# EAGLE schematic untitled2 (EAGLE 9.6.2)
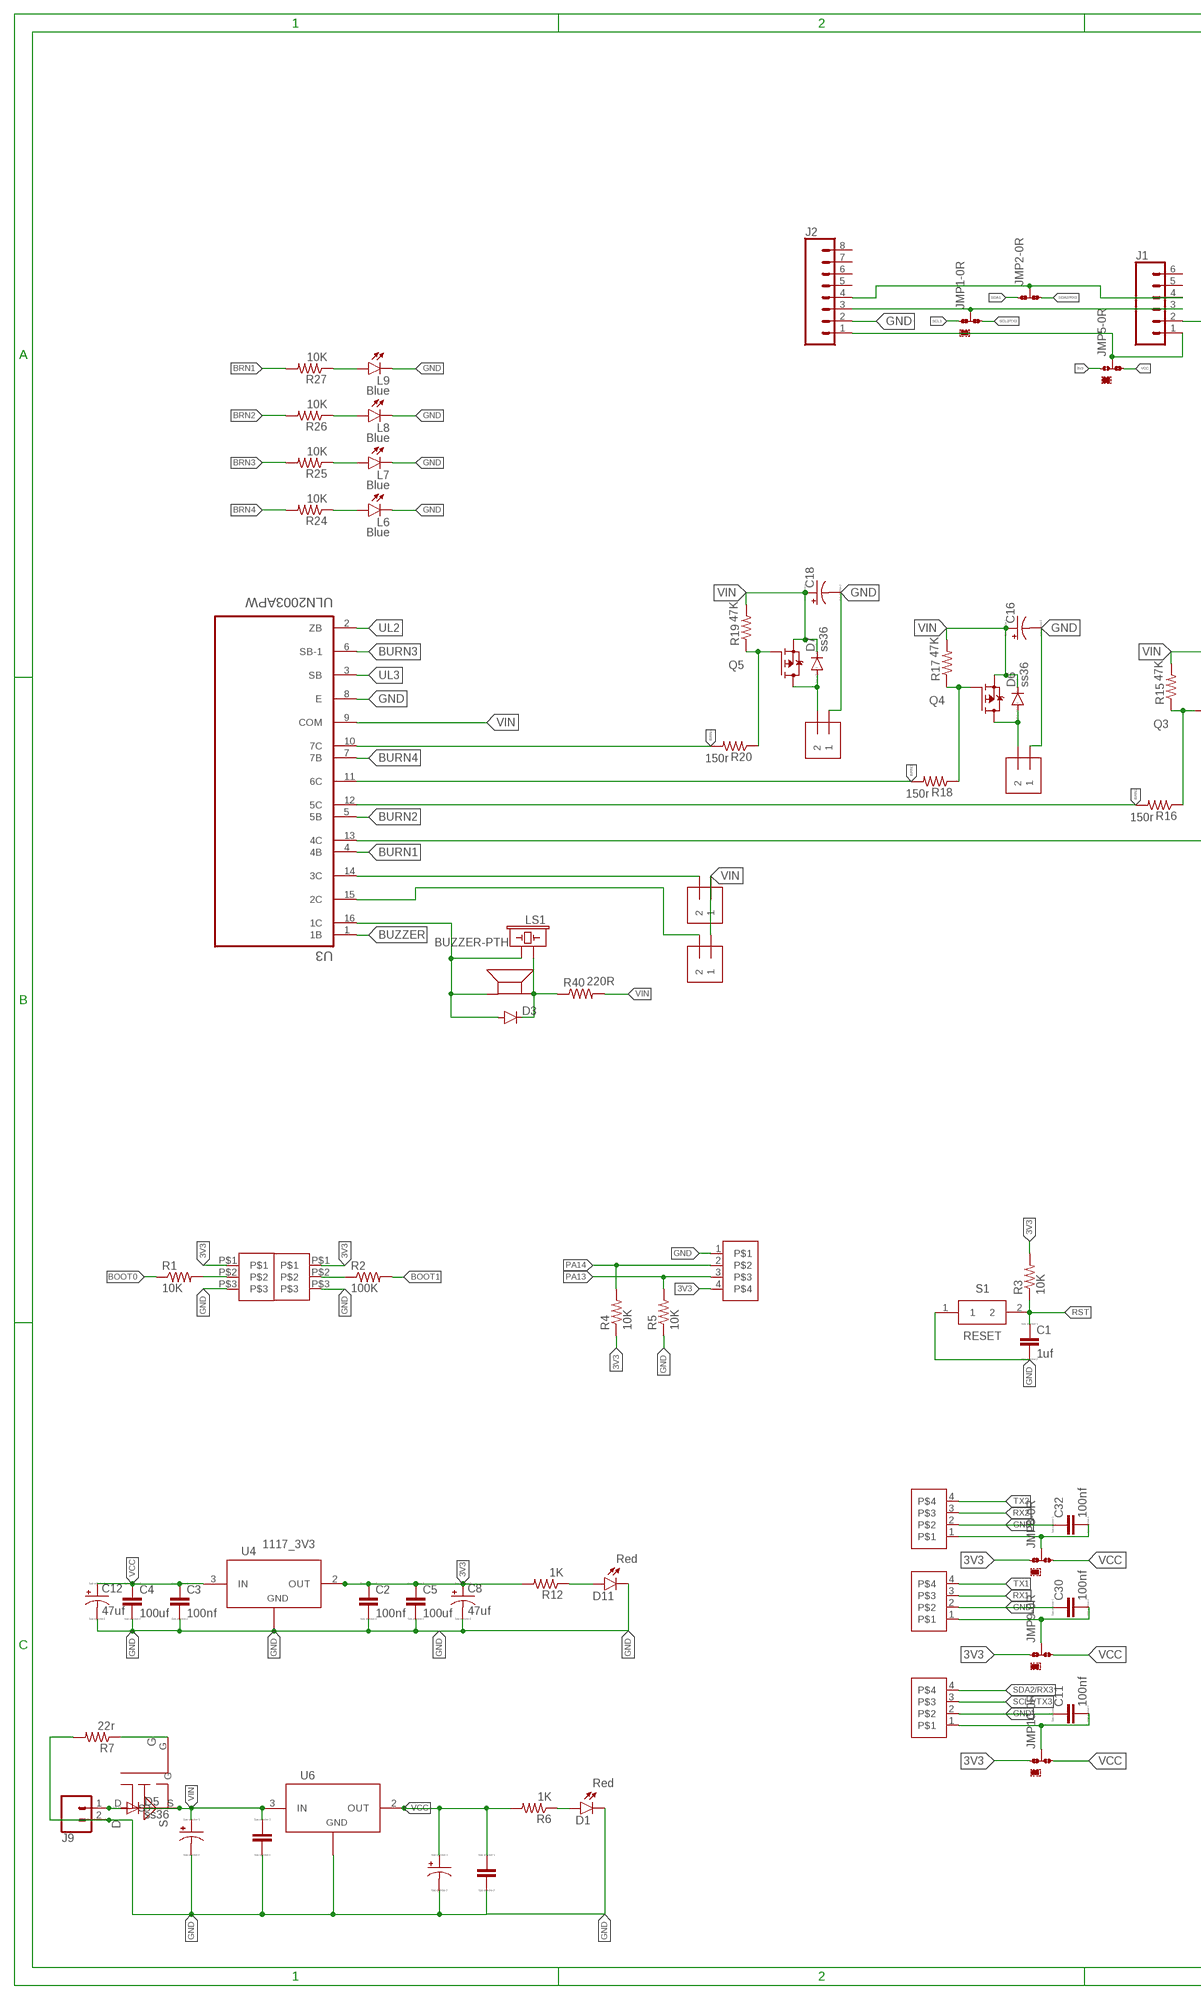
[diagram p0: schematic, sheet 1, part 1 of 2]
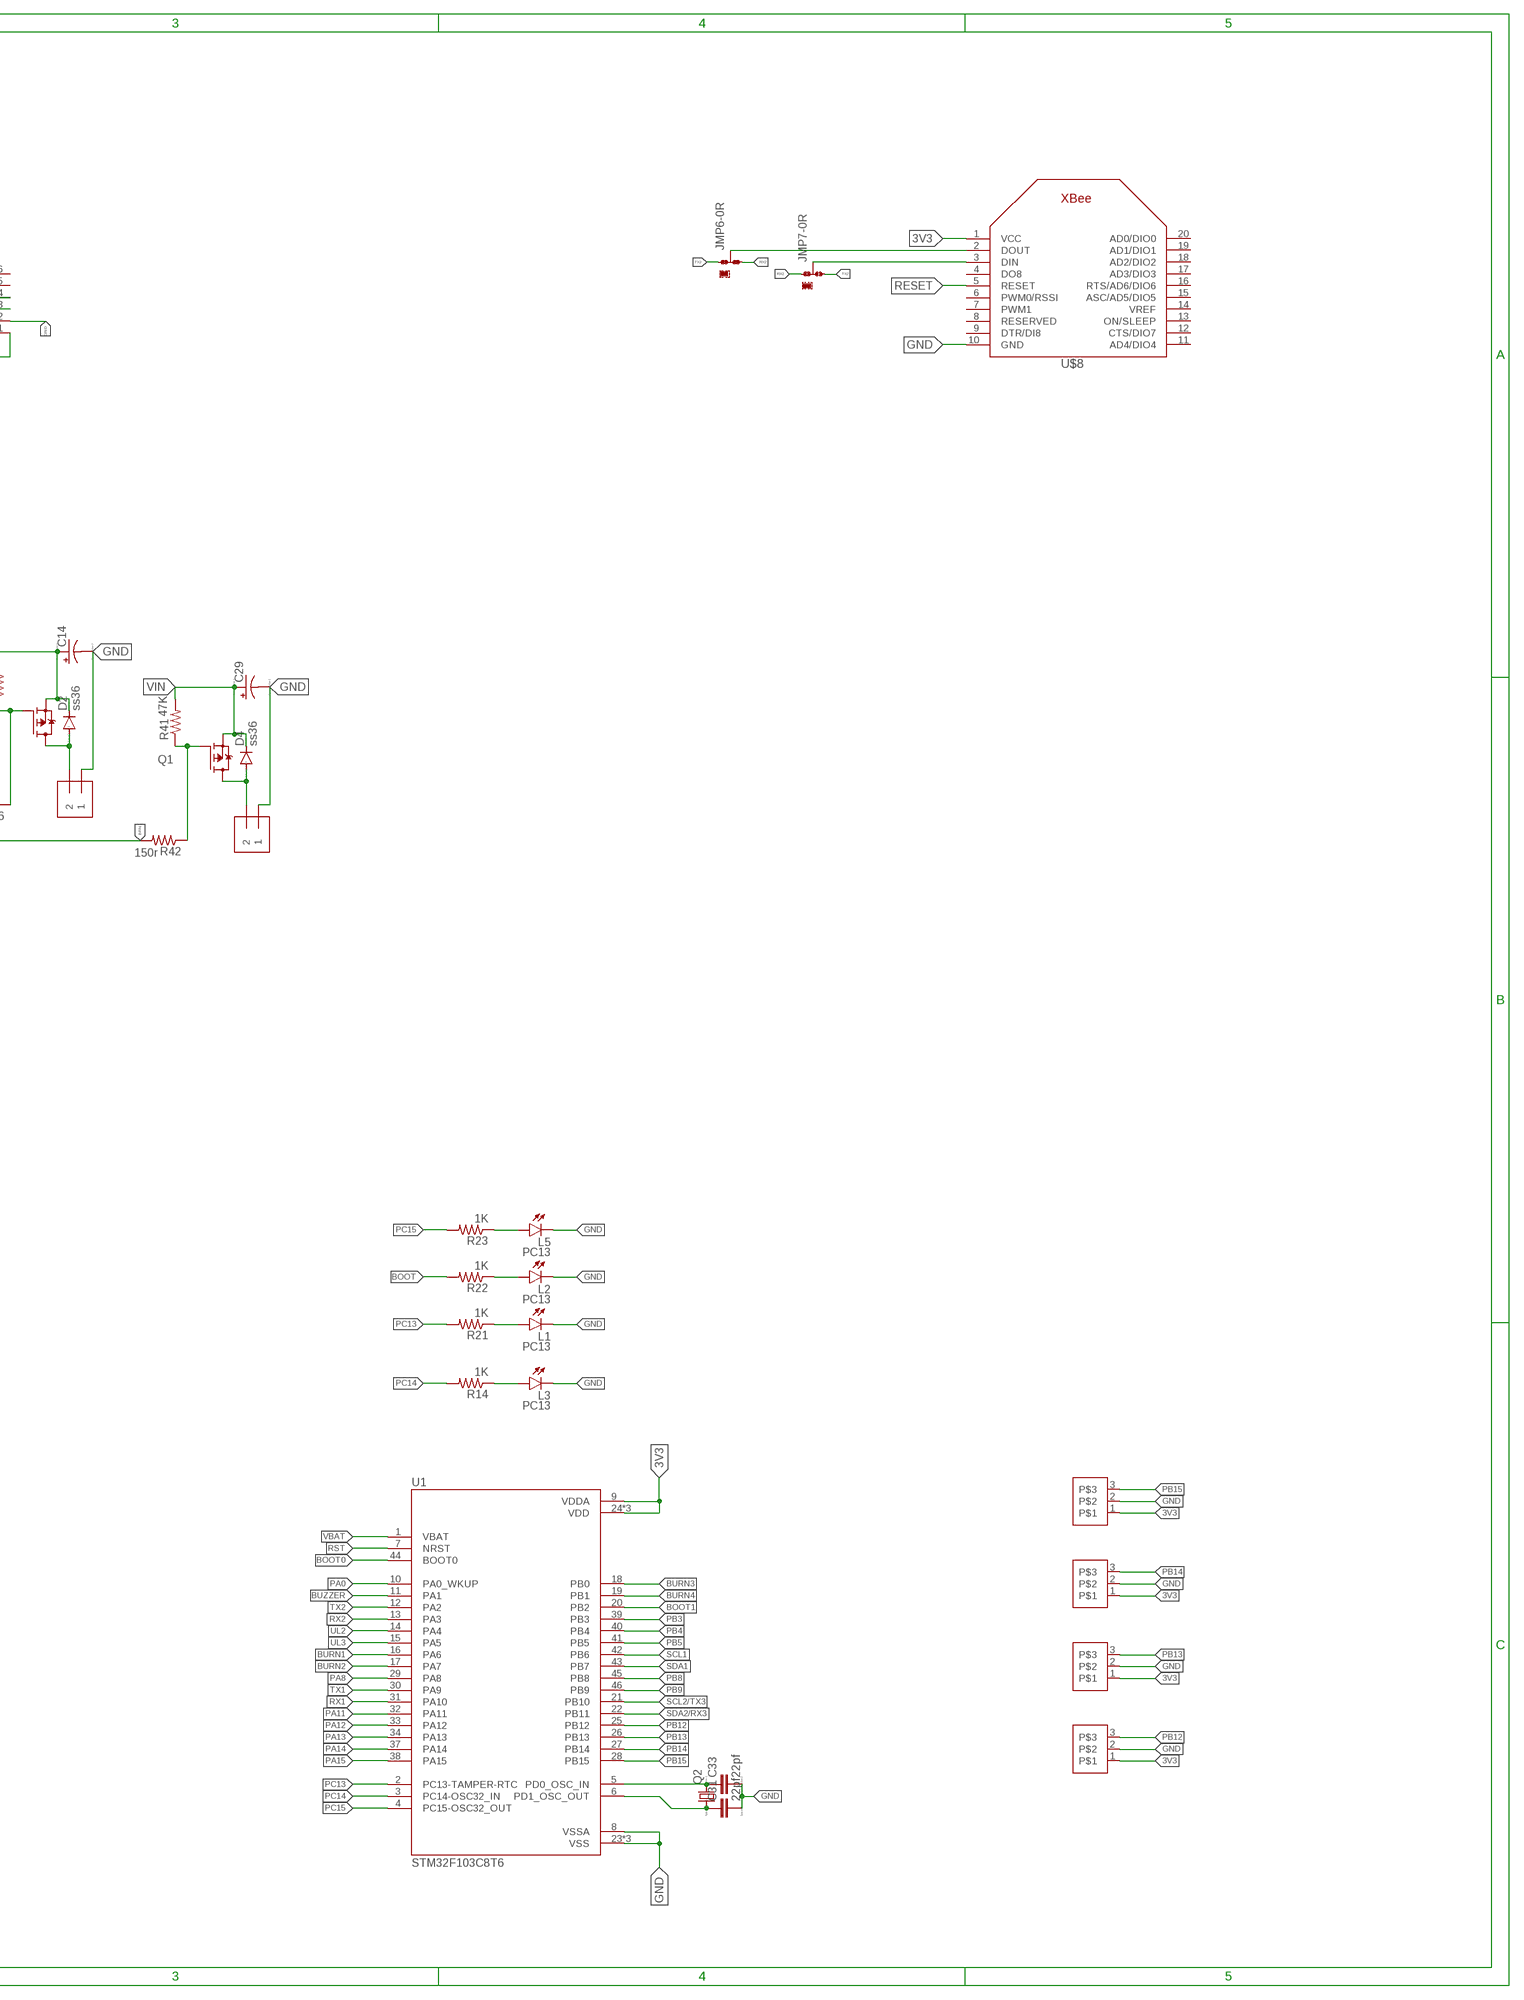
[diagram p1: schematic, sheet 1, part 2 of 2]

## Parts
C1  1uf  CAPACITOR_CER4  [C0603]
C2  100nf  CAPACITOR_CER4  [C0603]
C3  100nf  CAPACITOR_CER4  [C0603]
C4  100uf  CAPACITOR_CER9  [C1210]
C5  100uf  CAPACITOR_CER9  [C1210]
C6  100nf  CAPACITOR_CER4  [C0603]
C7  100uf  CAPACITOR_POLD  [PANASONIC_D]
C8  47uf  CAPACITOR_POLC  [PANASONIC_C]
C9  100nf  CAPACITOR_CER4  [C0603]
C10  100uf  CAPACITOR_POLD  [PANASONIC_D]
C11  100nf  CAPACITOR_CER4  [C0603]
C12  47uf  CAPACITOR_POLC  [PANASONIC_C]
C14  CAPACITOR_POLC  [PANASONIC_C]
C16  CAPACITOR_POLC  [PANASONIC_C]
C18  CAPACITOR_POLC  [PANASONIC_C]
C29  CAPACITOR_POLC  [PANASONIC_C]
C30  100nf  CAPACITOR_CER4  [C0603]
C31  22pf  CAPACITOR_CER4  [C0603]
C32  100nf  CAPACITOR_CER4  [C0603]
C33  22pf  CAPACITOR_CER4  [C0603]
D1  Red  LED0603_R  [0603_LED_GREEN]
D2  ss36  DIODEAC2  [DO-214AC]
D3  DIODESOD  [SOD-323]
D4  ss36  DIODEAC2  [DO-214AC]
D5  ss36  DIODEAC2  [DO-214AC]
D6  ss36  DIODEAC2  [DO-214AC]
D7  ss36  DIODEAC2  [DO-214AC]
D11  Red  LED0603_R  [0603_LED_GREEN]
J1  CONN_06NO_SILK_NO_POP  [1X06_NO_SILK]
J2  CONN_08NO_SILK_FEMALE_PTH  [1X08_NO_SILK]
J9  CONN_025MM  [SCREWTERMINAL-5MM-2]
JMP1  0R-JUMPA  [A0R-JMP]
JMP2  0R-JUMPA  [A0R-JMP]
JMP5  0R-JUMPA  [A0R-JMP]
JMP6  0R-JUMPA  [A0R-JMP]
JMP7  0R-JUMPA  [A0R-JMP]
JMP8  0R-JUMPA  [A0R-JMP]
JMP9  0R-JUMPA  [A0R-JMP]
JMP10  0R-JUMPA  [A0R-JMP]
L1  PC13  LED0603_R  [0603_LED_GREEN]
L2  PC13  LED0603_R  [0603_LED_GREEN]
L3  PC13  LED0603_R  [0603_LED_GREEN]
L5  PC13  LED0603_R  [0603_LED_GREEN]
L6  Blue  LED0603_R  [0603_LED_GREEN]
L7  Blue  LED0603_R  [0603_LED_GREEN]
L8  Blue  LED0603_R  [0603_LED_GREEN]
L9  Blue  LED0603_R  [0603_LED_GREEN]
LS1  BUZZER-PTH  [BUZZER-12MM]
Q1  FDD4141TO252  [TO252]
Q2  CRYSTALHC49U-V  [HC49U-V]
Q3  FDD4141TO252  [TO252]
Q4  FDD4141TO252  [TO252]
Q5  FDD4141TO252  [TO252]
Q6  AON7401  [DFN-8_3X3]
R1  10K  RESISTOR0603  [R0603]
R2  100K  RESISTOR0603  [R0603]
R3  10K  RESISTOR0603  [R0603]
R4  10K  RESISTOR0603  [R0603]
R5  10K  RESISTOR0603  [R0603]
R6  1K  RESISTOR0603  [R0603]
R7  22r  RESISTOR0603  [R0603]
R12  1K  RESISTOR0603  [R0603]
R14  1K  RESISTOR0603  [R0603]
R15  47K  RESISTOR0603  [R0603]
R16  150r  RESISTOR0603  [R0603]
R17  47K  RESISTOR0603  [R0603]
R18  150r  RESISTOR0603  [R0603]
R19  47K  RESISTOR0603  [R0603]
R20  150r  RESISTOR0603  [R0603]
R21  1K  RESISTOR0603  [R0603]
R22  1K  RESISTOR0603  [R0603]
R23  1K  RESISTOR0603  [R0603]
R24  10K  RESISTOR0603  [R0603]
R25  10K  RESISTOR0603  [R0603]
R26  10K  RESISTOR0603  [R0603]
R27  10K  RESISTOR0603  [R0603]
R40  220R  RESISTOR0603  [R0603]
R41  47K  RESISTOR0603  [R0603]
R42  150r  RESISTOR0603  [R0603]
S1  RESET  SKRKAEE010  [SKRK]
U1  STM32F103C8T6  [QFP50P900X900X160-48N]
U3  ULN2003APW  [SOP65P640X120-16N]
U4  1117_3V3  NCP1117ST33T3G  [SOT-223]
U6  1117_3V3  NCP1117ST33T3G  [SOT-223]
U$1  FML_1X32MM  [1X3_2MM]
U$2  FML_1X32MM  [1X3_2MM]
U$3  FML_1X4  [HDRVR4W64P254_1X4_1016X240X800B]
U$4  1X2  [1X2]
U$5  1X2  [1X2]
U$6  1X2  [1X2]
U$7  FML_1X4  [HDRVR4W64P254_1X4_1016X240X800B]
U$8  XBEE  [XBEE]
U$9  Z_STOP  FML_1X3  [HDRVR3W64P254_1X3_762X240X800B]
U$11  FML_1X4  [HDRVR4W64P254_1X4_1016X240X800B]
U$12  FML_1X4  [HDRVR4W64P254_1X4_1016X240X800B]
U$13  Z_STOP  FML_1X3  [HDRVR3W64P254_1X3_762X240X800B]
U$14  Y_STOP  FML_1X3  [HDRVR3W64P254_1X3_762X240X800B]
U$15  X_STOP  FML_1X3  [HDRVR3W64P254_1X3_762X240X800B]
U$19  7.5X7.5_BUZZER  [SMD_7.5_BUZZER]
U$20  1X2  [1X2]
U$21  1X2  [1X2]
U$22  1X2  [1X2]

## Nets
3V3: C2.1 C5.1 C8.+ JMP5.1 JMP8.1 JMP9.1 JMP10.1 R3.2 R4.1 R12.2 U1.9(VDDA) U1.24(VDD) U1.36(VDD) U1.48(VDD) U4.2(OUT) U4.4 U$1.P$1 U$2.P$1 U$3.4 U$8.1(VCC) U$9.1 U$13.1 U$14.1 U$15.1
BOOT: R1.2 R22.2 U$2.P$2
BOOT0: R1.1 U1.44(BOOT0)
BOOT1: R2.2 U1.20(PB2)
BRN1: R27.2 R42.2 U3.13(4C)
BRN2: R16.2 R26.2 U3.12(5C)
BRN3: R18.2 R25.2 U3.11(6C)
BRN4: R20.2 R24.2 U3.10(7C)
BURN1: U1.16(PA6) U3.4(4B)
BURN2: U1.17(PA7) U3.5(5B)
BURN3: U1.18(PB0) U3.6(SB-1)
BURN4: U1.19(PB1) U3.7(7B)
BUZZER: U1.11(PA1) U3.1(1B)
GND: C1.2 C2.2 C3.2 C4.2 C5.2 C6.2 C7.- C8.- C9.2 C10.- C11.1 C12.- C14.- C16.- C18.- C29.- C30.1 C31.2 C32.1 C33.2 D1.C D11.C J1.2 J2.2 J9.2 L1.C L2.C L3.C L5.C L6.C L7.C L8.C L9.C R5.1 R7.2 S1.1 U1.8(VSSA) U1.23(VSS) U1.35(VSS) U1.47(VSS) U3.8(E) U4.1(ADJ/GND) U6.1(ADJ/GND) U$1.P$3 U$2.P$3 U$3.1 U$4.P$1 U$5.P$1 U$6.P$1 U$7.2 U$8.10(GND) U$9.2 U$11.2 U$12.2 U$13.2 U$14.2 U$15.2 U$21.P$1
N$2: Q6.G R7.1
N$5: R2.1 U$1.P$2
N$7: D1.A R6.1
N$8: D11.A R12.1
N$9: JMP6.2 U$8.2(DOUT)
N$10: JMP7.2 U$8.3(DIN)
N$11: C30.2 JMP9.2 U$12.1
N$12: L3.A R14.1
N$13: D2.A Q3.3(D) U$4.P$2
N$14: Q3.1(G) R15.1 R16.1
N$15: D6.A Q4.3(D) U$5.P$2
N$16: Q4.1(G) R17.1 R18.1
N$17: D7.A Q5.3(D) U$6.P$2
N$18: Q5.1(G) R19.1 R20.1
N$19: C33.1 Q2.2 U1.5(PD0_OSC_IN)
N$20: C31.1 Q2.1 U1.6(PD1_OSC_OUT)
N$21: L1.A R21.1
N$22: L2.A R22.1
N$23: L5.A R23.1
N$24: L6.A R24.1
N$25: L7.A R25.1
N$26: L8.A R26.1
N$27: L9.A R27.1
N$28: C11.2 JMP10.2 U$7.1
N$29: J1.1 J2.1 JMP5.2
N$30: J1.3 J2.3 JMP1.2
N$31: J1.4 J2.4 JMP2.2
N$49: C32.2 JMP8.2 U$11.1
N$59: D5.A J9.1 Q6.D
N$71: U3.15(2C) U$20.P$2
N$72: U3.14(3C) U$22.P$2
N$76: D3.A LS1.- U3.16(1C) U$19.-
N$77: D3.C LS1.+ R40.1 U$19.+
N$78: D4.A Q1.3(D) U$21.P$2
N$79: Q1.1(G) R41.1 R42.1
PA0: U1.10(PA0_WKUP)
PA8: U1.29(PA8)
PA11: U1.32(PA11)
PA12: U1.33(PA12)
PA13: R5.2 U1.34(PA13) U$3.3
PA14: R4.2 U1.37(PA14) U$3.2
PA15: U1.38(PA15)
PB3: U1.39(PB3)
PB4: U1.40(PB4)
PB5: U1.41(PB5)
PB8: U1.45(PB8)
PB9: U1.46(PB9)
PB12: U1.25(PB12) U$15.3
PB13: U1.26(PB13) U$14.3
PB14: U1.27(PB14) U$13.3
PB15: U1.28(PB15) U$9.3
PC13: R21.2 U1.2(PC13-TAMPER-RTC)
PC14: R14.2 U1.3(PC14-OSC32_IN)
PC15: R23.2 U1.4(PC15-OSC32_OUT)
RESET: U$8.5(RESET)
RST: C1.1 R3.1 S1.2 U1.7(NRST)
RX1: U1.31(PA10) U$12.3
RX2: JMP6.3 JMP7.1 U1.13(PA3) U$11.3
SCL1: JMP1.1 U1.42(PB6)
SCL2/TX3: JMP1.3 U1.21(PB10) U$7.3
SDA1: JMP2.1 U1.43(PB7)
SDA2/RX3: JMP2.3 U1.22(PB11) U$7.4
TX1: U1.30(PA9) U$12.4
TX2: JMP6.1 JMP7.3 U1.12(PA2) U$11.4
UL2: U1.14(PA4) U3.2(ZB)
UL3: U1.15(PA5) U3.3(SB)
VBAT: U1.1(VBAT)
VCC: C3.1 C4.1 C6.1 C7.+ C12.+ JMP5.3 JMP8.3 JMP9.3 JMP10.3 R6.2 U4.3(IN) U6.2(OUT) U6.4
VIN: C9.1 C10.+ C14.+ C16.+ C18.+ C29.+ D2.C D4.C D5.C D6.C D7.C Q1.2(S) Q3.2(S) Q4.2(S) Q5.2(S) Q6.S R15.2 R17.2 R19.2 R40.2 R41.2 U3.9(COM) U6.3(IN) U$20.P$1 U$22.P$1
Unconnected: J1.5 J1.6 J2.5 J2.6 J2.7 J2.8 U$8.4(DO8) U$8.6(PWM0/RSSI) U$8.7(PWM1) U$8.8(RESERVED) U$8.9(DTR/DI8) U$8.11(AD4/DIO4) U$8.12(CTS/DIO7) U$8.13(ON/SLEEP) U$8.14(VREF) U$8.15(ASC/AD5/DIO5) U$8.16(RTS/AD6/DIO6) U$8.17(AD3/DIO3) U$8.18(AD2/DIO2) U$8.19(AD1/DIO1) U$8.20(AD0/DIO0)

## Library data of the parts
C1-C6 C9 C11 C30-C33 = pasif_com1:CAPACITOR_CER
C7 C8 C10 C12 C14 C16 C18 C29 = pasif_com1:CAPACITOR_POL
D1 D11 L1-L3 L5-L9 = pasif_com1:LED
D2 D4-D7 = pasif_com1:DIODE
D3 = BeagleBone_Blue_R3:DIODE: Diode These are standard reverse protection diodes and small signal diodes. SMA package can handle up to about 1A. SOD-323 can handle about 200mA. What the SOD-323 package when ordering, there are some mfgs out there that are 5-pin packages.; PROD_ID: DIO-09646
J1 = SparkFun-Connectors:CONN_06: Multi connection point. Often used as Generic Header-pin footprint for 0.1 inch spaced/style header connections On any of the 0.1 inch spaced packages, you can populate with these: Break Away Headers - Straight <https://www.sparkfun.com/products/116> (PRT-00116) Break Away Male Headers - Right Angle <https://www.sparkfun.com/products/553> (PRT-00553) Female Headers <https://www.sparkfun.com/products/115> (PRT-00115) Break Away Headers - Machine Pin <https://www.sparkfun.com/products/117> (PRT-00117) Break Away Female Headers - Swiss Machine Pin <https://www.sparkfun.com/products/743> (PRT-00743) Arduino Stackable Header - 6 Pin <https://www.sparkfun.com/products/9280> (PRT-09280) For SCREWTERMINALS and SPRING TERMINALS visit here: Screw Terimnals on SparkFun.com <https://www.sparkfun.com/search/results?term=Screw+Terminals> (5mm/3.5mm/2.54mm spacing) This device is also useful as a general connection point to wire up your design to another part of your project. Our various solder wires solder well into these plated through hole pads. Hook-Up Wire - Assortment (Stranded, 22 AWG) <https://www.sparkfun.com/products/11375> (PRT-11375) Hook-Up Wire - Assortment (Solid Core, 22 AWG) <https://www.sparkfun.com/products/11367> (PRT-11367) View the entire wire category on our website here <https://www.sparkfun.com/categories/141>
J2 = SparkFun-Connectors:CONN_08: Multi connection point. Often used as Generic Header-pin footprint for 0.1 inch spaced/style header connections On any of the 0.1 inch spaced packages, you can populate with these: Break Away Headers - Straight <https://www.sparkfun.com/products/116> (PRT-00116) Break Away Male Headers - Right Angle <https://www.sparkfun.com/products/553> (PRT-00553) Female Headers <https://www.sparkfun.com/products/115> (PRT-00115) Break Away Headers - Machine Pin <https://www.sparkfun.com/products/117> (PRT-00117) Break Away Female Headers - Swiss Machine Pin <https://www.sparkfun.com/products/743> (PRT-00743) Arduino Stackable Header - 8 Pin <https://www.sparkfun.com/products/9279> (PRT-09279) For SCREWTERMINALS and SPRING TERMINALS visit here: Screw Terimnals on SparkFun.com <https://www.sparkfun.com/search/results?term=Screw+Terminals> (5mm/3.5mm/2.54mm spacing) This device is also useful as a general connection point to wire up your design to another part of your project. Our various solder wires solder well into these plated through hole pads. Hook-Up Wire - Assortment (Stranded, 22 AWG) <https://www.sparkfun.com/products/11375> (PRT-11375) Hook-Up Wire - Assortment (Solid Core, 22 AWG) <https://www.sparkfun.com/products/11367> (PRT-11367) View the entire wire category on our website here <https://www.sparkfun.com/categories/141> Special notes: Molex polarized connector foot print use with SKU : PRT-08231 with associated crimp pins and housings. 1MM SMD Version SKU: PRT-10208 NOTES ON THE VARIANTS LOCK and LOCK_LONGPADS... This footprint was designed to help hold the alignment of a through-hole component (i.e. 6-pin header) while soldering it into place. You may notice that each hole has been shifted either up or down by 0.005 of an inch from it's more standard position (which is a perfectly straight line). This slight alteration caused the pins (the squares in the middle) to touch the edges of the holes. Because they are alternating, it causes a "brace" to hold the component in place. 0.005 has proven to be the perfect amount of "off-center" position when using our standard breakaway headers. Although looks a little odd when you look at the bare footprint, once you have a header in there, the alteration is very hard to notice. Also,if you push a header all the way into place, it is covered up entirely on the bottom side.; PROD_ID: CONN-08438
J9 = SparkFun-Connectors:CONN_02: Multi connection point. Often used as Generic Header-pin footprint for 0.1 inch spaced/style header connections On any of the 0.1 inch spaced packages, you can populate with these: Break Away Headers - Straight <https://www.sparkfun.com/products/116> (PRT-00116) Break Away Male Headers - Right Angle <https://www.sparkfun.com/products/553> (PRT-00553) Female Headers <https://www.sparkfun.com/products/115> (PRT-00115) Break Away Headers - Machine Pin <https://www.sparkfun.com/products/117> (PRT-00117) Break Away Female Headers - Swiss Machine Pin <https://www.sparkfun.com/products/743> (PRT-00743) For SCREWTERMINALS and SPRING TERMINALS visit here: Screw Terimnals on SparkFun.com <https://www.sparkfun.com/search/results?term=Screw+Terminals> (5mm/3.5mm/2.54mm spacing) This device is also useful as a general connection point to wire up your design to another part of your project. Our various solder wires solder well into these plated through hole pads. Hook-Up Wire - Assortment (Stranded, 22 AWG) <https://www.sparkfun.com/products/11375> (PRT-11375) Hook-Up Wire - Assortment (Solid Core, 22 AWG) <https://www.sparkfun.com/products/11367> (PRT-11367) View the entire wire category on our website here <https://www.sparkfun.com/categories/141> Special notes: Molex polarized connector foot print use with: PRT-08233 with associated crimp pins and housings. 2.54_SCREWTERM for use with PRT-10571. 3.5mm Screw Terminal footprints for PRT-08084 5mm Screw Terminal footprints for use with PRT-08432; SF_SKU: PRT-08432
JMP1 JMP2 JMP5-JMP10 = jump-0r-smd:0R-JUMP: SMD 0R 0805 Jumper
LS1 = SparkFun-Electromechanical:BUZZER: Buzzer Small round buzzers that operate around the audible 2kHz range. You can use these as speakers to create simple music or user interfaces. Variant Overview: PTH - Mini Speaker - PC Mount 12mm 2.048kHz <https://www.sparkfun.com/products/7950> PTH_KIT - Mini Speaker - PC Mount 12mm 2.048kHz <https://www.sparkfun.com/products/7950> KIT simplifies soldering by adding stop mask to one side of the pads. PTH_NO_SILK - Mini Speaker - PC Mount 12mm 2.048kHz <https://www.sparkfun.com/products/7950> No silkscreen indicator of buzzer outline. PTH_KIT_NO_SILK - Mini Speaker - PC Mount 12mm 2.048kHz <https://www.sparkfun.com/products/7950> KIT package w/o silkscreen SMD - Buzzer Audio Magnetic (CCV-084B16) SMD buzzer used on, e.g. the LilyPad Buzzer <https://www.sparkfun.com/products/8463> and RFID USB Reader <https://www.sparkfun.com/products/9963>. SMD_KIT - Buzzer Audio Magnetic (CCV-084B16) SMD Buzzer with elongated pins to make soldering easier. Used on the SparkFun Simon Says - Surface Mount Soldering Kit <https://www.sparkfun.com/products/10935>.; PROD_ID: COMP-08253; SF_SKU: COM-07950
Q1 Q3-Q5 = transistor-fet:FDD4141: P-Channel PowerTrench® MOSFET Source: FDD4141.pdf
Q2 = crystal:CRYSTAL: CRYSTAL; OC_FARNELL: 1666969; OC_NEWARK: unknown
Q6 = AON7401:AON7401
R1-R7 R12 R14-R27 R40-R42 = pasif_com1:RESISTOR
S1 = SKRKAEE010:SKRKAEE010: Tactile Switches 3.9x2.9x2.0mm 160gf Packaging Temp 60oC <https://componentsearchengine.com/Images/1/SKRKAEE010.jpg> Source: Datasheet <http://www.mouser.com/ds/2/15/SKRK-1110686.pdf>; AVAILABILITY: Unavailable; DESCRIPTION: Switch Tactile N.O. SPST Round Button Gull Wing 0.05A 12VDC 1.57N SMD T/R; MF: ALPS; MP: SKRKAEE010; PACKAGE: None; PRICE: None
U1 = STM32F103C8T6:STM32F103C8T6: Mainstream Performance line, ARM Cortex-M3 MCU with 64 Kbytes Flash, 72 MHz CPU, motor control, USB and CAN; AVAILABILITY: Unavailable; DESCRIPTION: Mainstream Performance line, ARM Cortex-M3 MCU with 64 Kbytes Flash, 72 MHz CPU, motor control, USB and CAN; MF: STMicroelectronics; MP: STM32F103C8T6; PACKAGE: LQFP-48 STMicroelectronics; PRICE: None
U3 = ULN2003APW:ULN2003APW: Check prices <https://pricing.snapeda.com/parts/ULN2003APW/Texas%20Instruments/view-part?ref=eda>; AVAILABILITY: Good; DESCRIPTION: 50-V, 7-ch darlington transistor array, -20C to 70C 16-TSSOP -40 to 70; MF: Texas Instruments; MP: ULN2003APW; PACKAGE: TSSOP-16 Texas Instruments; PRICE: None; PURCHASE-URL: https://pricing.snapeda.com/search/part/ULN2003APW/?ref=eda
U4 U6 = IC:NCP1117ST33T3G: IC REG LINEAR 3.3V 1A SOT223 Manufacturer's datasheet <https://www.onsemi.com/pub/Collateral/NCP1117-D.PDF>; CREATED_BY: PCBLayout.com; DIGIKEY_PART_NUMBER: NCP1117ST33T3GOSTR-ND; MANUFACTURER: ON Semiconductor; MPN: NCP1117ST33T3G; PACKAGE: SOT-223
U$1 U$2 U$9 U$13-U$15 = header_3d:FML_1X3
U$3 U$7 U$11 U$12 = header_3d:FML_1X4
U$4-U$6 U$20-U$22 = header_3d:1X2
U$8 = adafruit:XBEE
U$19 = buzzer_smd_no_drill:7.5X7.5_BUZZER